# Altium schematic sheet MCU_Interconnect_Rev1.SchDoc
size A
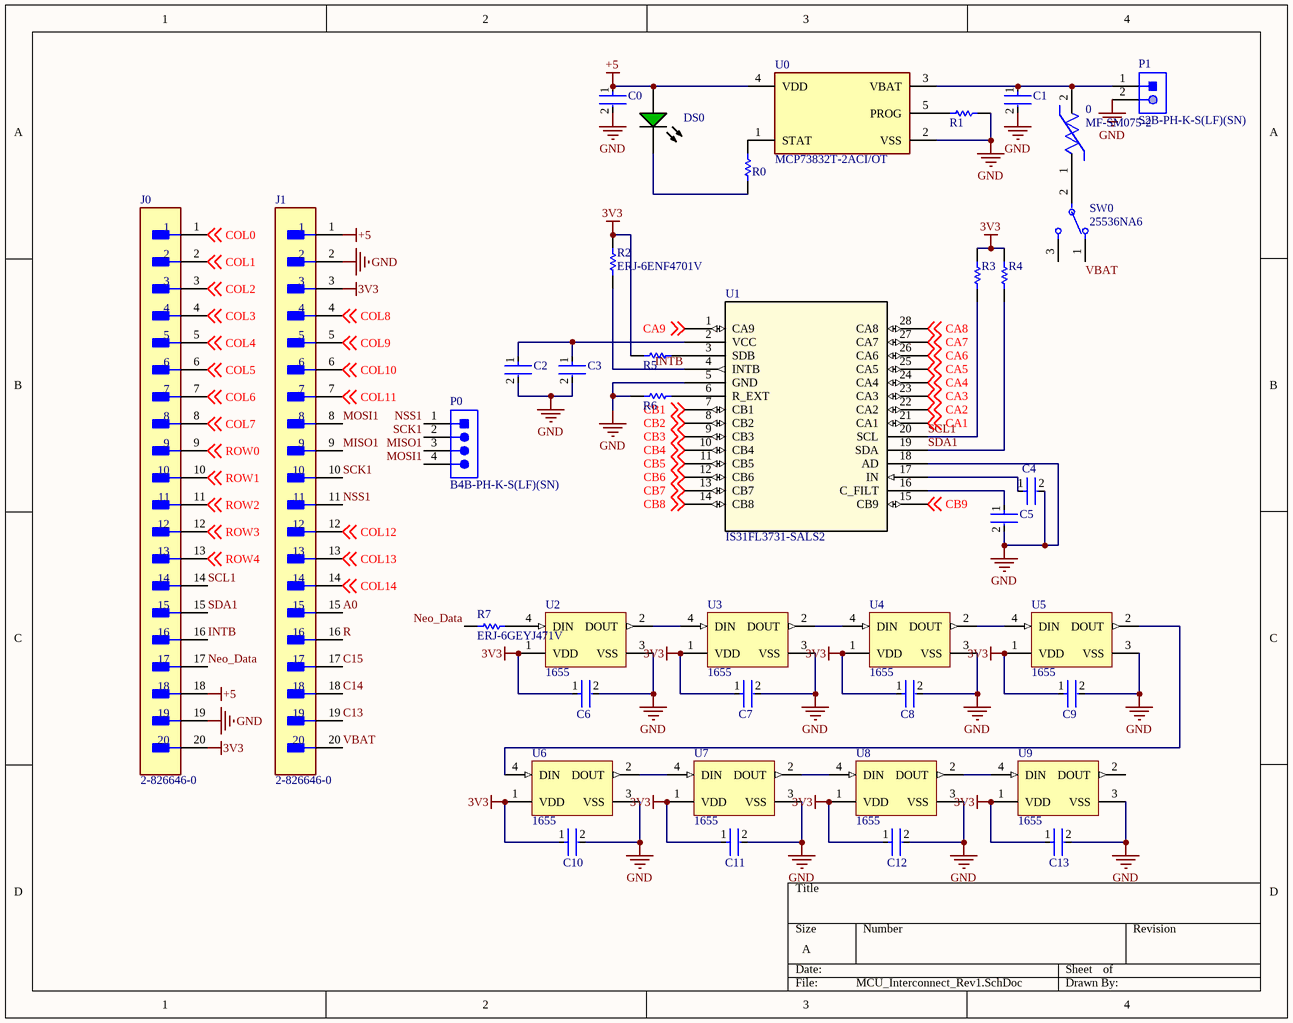
[diagram p0: MCU_Interconnect_Rev1.SchDoc]

## Parts
0  MF-SM075-2  [FP-MF-SM075-MFG]
C0  GRM21BR71C475KE51L  [FP-GRM21B-0_15-IPC_C]  (value not drawn)
C1  GRM21BR71C475KE51L  [FP-GRM21B-0_15-IPC_C]  (value not drawn)
C2  GRM219R7YA105KA12D  [FP-GRM219-0_1-MFG]  (value not drawn)
C3  GRM21B7U1A104JA01L  [FP-GRM21B-0_1-IPC_B]  (value not drawn)
C4  GCM21BR71H224KA37L  [FP-GCM21B-0_15-IPC_C]  (value not drawn)
C5  GRM21B7U1A104JA01L  [FP-GRM21B-0_1-IPC_B]  (value not drawn)
C6  GRM21B7U1A104JA01L  [FP-GRM21B-0_1-IPC_B]  (value not drawn)
C7  GRM21B7U1A104JA01L  [FP-GRM21B-0_1-IPC_B]  (value not drawn)
C8  GRM21B7U1A104JA01L  [FP-GRM21B-0_1-IPC_B]  (value not drawn)
C9  GRM21B7U1A104JA01L  [FP-GRM21B-0_1-IPC_B]  (value not drawn)
C10  GRM21B7U1A104JA01L  [FP-GRM21B-0_1-IPC_B]  (value not drawn)
C11  GRM21B7U1A104JA01L  [FP-GRM21B-0_1-IPC_B]  (value not drawn)
C12  GRM21B7U1A104JA01L  [FP-GRM21B-0_1-IPC_B]  (value not drawn)
C13  GRM21B7U1A104JA01L  [FP-GRM21B-0_1-IPC_B]  (value not drawn)
DS0  LTST-C170KGKT  [LTST-LTST-C170KGKT-2_V]  (value not drawn)
J0  2-826646-0  [FP-2-826646-0-MFG]
J1  2-826646-0  [FP-2-826646-0-MFG]
P0  B4B-PH-K-S(LF)(SN)  [JST-B4B-PH-K-S_V]
P1  S2B-PH-K-S(LF)(SN)  [JST-S2B-PH-K-S_V]
R0  RC0805FR-07470RL  [RESC2013X60X35LL10T20]  (value not drawn)
R1  ERJ-6ENF1001V  [RESC2013X70X40ML20T20]  (value not drawn)
R2  ERJ-6ENF4701V  [RESC2013X70X40NL20T20]
R3  ERJ-6ENF4701V  [RESC2013X70X40NL20T20]  (value not drawn)
R4  ERJ-6ENF4701V  [RESC2013X70X40NL20T20]  (value not drawn)
R5  ERJ-6ENF1003V  [RESC2013X70X40ML20T20]  (value not drawn)
R6  ERJ-6ENF1003V  [RESC2013X70X40ML20T20]  (value not drawn)
R7  ERJ-6GEYJ471V  [RESC2013X70X40LL20T20]
SW0  25536NA6  [FP-25536NA6-0]
U0  MCP73832T-2ACI/OT  [FP-C04-091-OT-MFG]
U1  IS31FL3731-SALS2  [SSOP-28_ISI]
U2  1655  [ADA-RGB-1655_V]
U3  1655  [ADA-RGB-1655_V]
U4  1655  [ADA-RGB-1655_V]
U5  1655  [ADA-RGB-1655_V]
U6  1655  [ADA-RGB-1655_V]
U7  1655  [ADA-RGB-1655_V]
U8  1655  [ADA-RGB-1655_V]
U9  1655  [ADA-RGB-1655_V]

## Nets
3V3: C6.1 C7.1 C8.1 C9.1 C10.1 C11.1 C12.1 C13.1 J0.20 J1.3 R2.2 R3.2 R4.2 R5.1 U2.1(VDD) U3.1(VDD) U4.1(VDD) U5.1(VDD) U6.1(VDD) U7.1(VDD) U8.1(VDD) U9.1(VDD)
+5: C0.1 DS0.2(A) J0.18 J1.1 U0.4(VDD)
GND: C0.2 C1.2 C2.2 C3.2 C4.2 C5.2 C6.2 C7.2 C8.2 C9.2 C10.2 C11.2 C12.2 C13.2 J0.19 J1.2 P1.2 R1.1 R6.1 U0.2(VSS) U1.5(GND) U1.18(AD) U2.3(VSS) U3.3(VSS) U4.3(VSS) U5.3(VSS) U6.3(VSS) U7.3(VSS) U8.3(VSS) U9.3(VSS)
A0: J1.15
C13: J1.19
C14: J1.18
C15: J1.17
CA1: U1.21(CA1) ; off-sheet CA1
CA2: U1.22(CA2) ; off-sheet CA2
CA3: U1.23(CA3) ; off-sheet CA3
CA4: U1.24(CA4) ; off-sheet CA4
CA5: U1.25(CA5) ; off-sheet CA5
CA6: U1.26(CA6) ; off-sheet CA6
CA7: U1.27(CA7) ; off-sheet CA7
CA8: U1.28(CA8) ; off-sheet CA8
CA9: U1.1(CA9) ; off-sheet CA9
CB1: U1.7(CB1) ; off-sheet CB1
CB2: U1.8(CB2) ; off-sheet CB2
CB3: U1.9(CB3) ; off-sheet CB3
CB4: U1.10(CB4) ; off-sheet CB4
CB5: U1.11(CB5) ; off-sheet CB5
CB6: U1.12(CB6) ; off-sheet CB6
CB7: U1.13(CB7) ; off-sheet CB7
CB8: U1.14(CB8) ; off-sheet CB8
CB9: U1.15(CB9) ; off-sheet CB9
COL0: J0.1 ; off-sheet COL0
COL1: J0.2 ; off-sheet COL1
COL2: J0.3 ; off-sheet COL2
COL3: J0.4 ; off-sheet COL3
COL4: J0.5 ; off-sheet COL4
COL5: J0.6 ; off-sheet COL5
COL6: J0.7 ; off-sheet COL6
COL7: J0.8 ; off-sheet COL7
COL8: J1.4 ; off-sheet COL8
COL9: J1.5 ; off-sheet COL9
COL10: J1.6 ; off-sheet COL10
COL11: J1.7 ; off-sheet COL11
COL12: J1.12 ; off-sheet COL12
COL13: J1.13 ; off-sheet COL13
COL14: J1.14 ; off-sheet COL14
INTB: J0.16 R2.1 U1.4(INTB)
MISO1: J1.9 P0.3
MOSI1: J1.8 P0.4
Neo_Data: J0.17 R7.1
NSS1: J1.11 P0.1
R: J1.16
ROW0: J0.9 ; off-sheet ROW0
ROW1: J0.10 ; off-sheet ROW1
ROW2: J0.11 ; off-sheet ROW2
ROW3: J0.12 ; off-sheet ROW3
ROW4: J0.13 ; off-sheet ROW4
SCK1: J1.10 P0.2
SCL1: J0.14 R3.1 U1.20(SCL)
SDA1: J0.15 R4.1 U1.19(SDA)
VBAT: J1.20 SW0.1
Net0_1: 0.1 SW0.2
Net0_2: 0.2 C1.1 P1.1 U0.3(VBAT)
NetC2_1: C2.1 C3.1 U1.2(VCC)
NetC4_1: C4.1 U1.17(IN)
NetC5_1: C5.1 U1.16(C_FILT)
NetDS0_1: DS0.1(K) R0.1
NetR0_2: R0.2 U0.1(STAT)
NetR1_2: R1.2 U0.5(PROG)
NetR5_2: R5.2 U1.3(SDB)
NetR6_2: R6.2 U1.6(R_EXT)
NetR7_2: R7.2 U2.4(DIN)
NetU2_2: U2.2(DOUT) U3.4(DIN)
NetU3_2: U3.2(DOUT) U4.4(DIN)
NetU4_2: U4.2(DOUT) U5.4(DIN)
NetU5_2: U5.2(DOUT) U6.4(DIN)
NetU6_2: U6.2(DOUT) U7.4(DIN)
NetU7_2: U7.2(DOUT) U8.4(DIN)
NetU8_2: U8.2(DOUT) U9.4(DIN)

Not connected (* = marked no-connect by the designer): SW0 3; U9 2(DOUT)

## Library data of the parts
0 = CMP-07400-000034-1: PTC RESET FUSE 30V 750MA 2SMD; Manufacturer: Bourns Inc.; Trip Time: 0.3s; Description: Polymeric PTC Resettable Fuse 30V 750mA Ih Surface Mount 2-SMD; Value: 0.23-1Ω; Trip Current: 1.5A; Current Rating: 80A; Hold Current: 0.75A; Automotive Grade: Grade 3; Manufacturer Part Number: MF-SM075-2; ComponentLink2URL: https://www.bourns.com/docs/Product-Datasheets/mfsm.pdf; Mouser Description: Fuse; Resettable; 0.75A; Dims 0.314x0.214x0.129"; SMT; 30VDC; DCR 0.23 Ohms; PCB; Lead Free: Yes; Device Class L1: Circuit Protection; Digikey Description: PTC RESET FUSE 30V 750MA 2SMD; Octopart: https://octopart.com/mf-sm075-2-bourns-115843; Category: Fuse; Device Class L2: PTC Resettable Fuses; Ambient Temperature Range Low: -40°C; Device Class L3: unset; Voltage Rating: 30V; Height: 3.18mm; Ambient Temperature Range High: +85°C; Resistance: 0.23-1Ω; Package: MF-SM075; ComponentLink2Description: Datasheet; Temperature Range High: +85°C; Automotive: Yes; Temperature Range Low: -40°C; Temperature: -40°C to +85°C; RoHS: TRUE
C0 C1 = CMP-06035-004324-1: Chip Multilayer Ceramic Capacitors for General Purpose, 0805, 4.7uF, X7R, 15%, 10%, 16V; Case/Package: 0805; Width: 1.25mm; Tolerance: 10%; Dielectric: X7R; Thickness: 1.25mm; Capacitance: 4.7uF; Voltage Rating (DC): 16V; Length: 2mm
C2 = CMP-06035-055256-1: Chip Multilayer Ceramic Capacitors for General Purpose, 0805, 1.0uF, X7R, 15%, 10%, 35V; Capacitance: 1uF; Thickness: 0.037inch; Package Quantity: 4000; Max Operating Temperature: 125°C; Length: 0.079inch; Case Code (Metric): 2012; Min Operating Temperature: -55°C; Voltage Rating: 35V; Mount: Surface Mount; Width: 1.25mm; Height: 0.85mm; Termination: SMD/SMT; Packaging: Tape and Reel; Voltage Rating (DC): 35V; Tolerance: 10%; Weight: 0.000335oz; Case Code (Imperial): 0805; Case/Package: 0805; Dielectric: X7R
C3 C5-C13 = CMP-06035-037063-1: Chip Multilayer Ceramic Capacitors for General Purpose, 0805, 0.10uF, U2J, -750ppm/°C, 5%, 10V; Capacitance: 100nF; Depth: 1.25mm; Voltage Rating (DC): 10V; Voltage Rating: 10V; Length: 2mm; Max Operating Temperature: 125°C; Thickness: 0.053inch; Dielectric: U2J; Termination: SMD/SMT; Package Quantity: 3000; Packaging: Tape and Reel; Case Code (Metric): 2012; Tolerance: 5%; Case Code (Imperial): 0805; Case/Package: 0805; Mount: Surface Mount; Width: 0.049inch; Height: 1.25mm; Radiation Hardening: No; Min Operating Temperature: -55°C
C4 = CMP-2007-03357-2: Ceramic Capacitor for Automotive 220nF ±10% 50VDC X7R 0805 Embossed T/R; Voltage Rating: 50V; Termination: SMD/SMT; Lead Free: Lead Free; Case/Package: 0805; Radiation Hardening: No; Width: 0.049inch; Height: 1.25mm; Mount: Surface Mount; Case Code (Metric): 2012; Min Operating Temperature: -55°C; Thickness: 0.055inch; Length: 2mm; Capacitance: 220nF; Ratings: AEC-Q200; Depth: 1.25mm; Voltage Rating (DC): 50V; REACH SVHC: No SVHC; Tolerance: 10%; Max Operating Temperature: 125°C; Voltage: 50V; Package Quantity: 1; Case Code (Imperial): 0805; Dielectric: X7R; Packaging: Tape and Reel
DS0 = CMP-2000-06620-1: Ultra Bright AlInGaP Chip LED, 75 mW, -55 to 85 degC, 2-Pin SMD (0805), RoHS, Tape and Reel; Manufacturer: Lite-On; Forward Current: 30mA; Power Dissipation Max: 75mW; Emitting Color: YellowGreen; Type: Uni-Color; Forward Voltage: 2.4V; Dominant Wave Length: 571nm; Test Current (It): 20mA; Product Length (mm): 2mm; Peak Wavelength: 574nm; Power Dissipation: 75W; Product Depth (mm): 1.25mm; DELETED: Compliant; High Brightness: Yes; Product Height (mm): 1.1mm; Luminous Intensity: 35mcd; Shape Type: Rectangular; Chip Material: AlGaInP; Viewing Angle: 130deg; Number of  Elements: 1; Reverse Voltage: 5V; Rad Hardened: No; Package Type: ChipLed; Manufacturer URL: http://www.us.liteon.com/; Mounting: SurfaceMount; Operating Temp Range: -55Cto85C; Datasheet URL: http://optoelectronics.liteon.com/upload/download/DS22-2000-073/S_110_LTST-C170KGKT.pdf; Packaging: TapeandReel; Pin Count: 2; Package Description: 2-Pin Surface Mounted Device, Body 2 x 1.25 mm; Mounting Technology: SurfaceMount; Package Reference: LTST-C170KGKT-2; Forward Current Max: 30mA; Datasheet Version: Rev. G, 06/2005; Lens Dimensions: 1.4x1.25x0.6mm; Operating Temperature Classification: Industrial; Lum Intensity: 35mcd; Main Category: ChipLED
J0 J1 = CMP-03369-000139-1: CONN HEADER VERT 20POS 2.54MM; Mating Connector Lock: No (Without); High Temperature Housing: No; Current Rating: 3A; Number of Positions: 20; PCB Mounting Orientation: Vertical; Connector Type: Plug; PCB Mount Retention: Without; Plating Thickness: 0.8um; Contact Post Length: 0.1259inch; Selectively Loaded: No (Without); Series: AMPMODU MOD II; Number of Rows: 1; Housing Color: Green; Mount: Straddle Mount; Max Operating Temperature: 105°C; Packaging: Carton; Row Spacing: 2.54mm; Board Standoff: No (Without); RoHS Compliant: Yes; Orientation: Straight; Contact Protection: No (Without); Strain Relief: No (Without); Keyed: No; Radiation Hardening: No; Package Quantity: 300; Contact Mating Length: 5.8mm; Termination: Through Hole; Contact Shape: Square; Length: 50.8mm; Pitch: 2.54mm; Stabilizers: No (Without); Gasket: No (Without); Number of Contacts: 20; Contact Gender: Male; Mating Alignment: No (Without); Min Operating Temperature: -65°C; Contact Type: Male Pin; Contact Plating: Gold; Flammability Rating: UL94 V-0; Housing Material: PBT; Color: Green; High Speed Serial Data Connector: No; Depth: 2.5mm; ELV: Compliant; Contact Material: Bronze
P0 = CMP-2000-05165-1: Male Header, Pitch 2 mm, 1 x 4 Position, Height 6 mm, Tail Length 3.4 mm, -25 to 85 degC, RoHS, Bulk; Manufacturer: JST; No of Positions: 4; Style/Orientation: StraightHeader/Plug; Pitch: 2mm; Datasheet URL: http://datasheet.octopart.com/B4B-PH-K-S%28LF%29%28SN%29-JST-datasheet-10558886.pdf; Type: ShroudedHeader; Manufacturer URL: http://www.jst.com/home2.html; Termination: Crimp; Datasheet Version: Apr-09
P1 = CMP-1755-00004-1: Male Header, Pitch 2 mm, 1 x 2 Position, Height 4.8 mm, Tail Length 3.4 mm, -25 to 85 degC, RoHS, Bulk; Case\Package: Radial; Tolerance: 20%; Capacitance: 10 uF; Voltage Rating (DC): 50 V; Packaging: Bulk; ComponentLink1URL: http://www.jst-mfg.com/product/pdf/eng/ePH.pdf; Radiation Hardening: No; Height: 11 mm; Package Quantity: 200; PackageDescription: Male Header, Pitch 2 mm, 1 x 2 Position, Height 4.8 mm, Tail Length 3.4 mm; PackageReference: S2B-PH-K-S; Diameter: 5 mm; Pins: 2; Mount: Through Hole; Max Operating Temperature: 85 degC; Min Operating Temperature: -40 degC; ComponentLink1Description: Datasheet; DatasheetVersion: Dec-12; Length: 11 mm; Lead Pitch: 2 mm; REACH SVHC: No SVHC; Voltage Rating: 50 V; RoHSCompliant: true
R0 = CMP-2000-06961-1: Chip Resistor, 470 Ohm, +/- 1%, 125 mW, -55 to 155 degC, 0805 (2012 Metric), RoHS, Tape and Reel; Manufacturer: Yageo; Power Rating: 250mW; Resistor Case Style: 0805[2012Metric]; Voltage Rating: 150V; Resistor Element Type: ThickFilm; Temperature Coefficient: ±100ppm/°C; Resistance: 470ohm; SVHC: ToBeAdvised; Datasheet Version: Rev. 7, 05/2017; Automotive Qualification Standard: -; Mounting Technology: SurfaceMount; Product Range: -; Packaging: Tape&Reel; Package Description: 2-Pin Surface Mounted Device, Body 2 x 1.25 mm; MSL: MSL1-Unlimited; Package Reference: 0805; Resistance Tolerance: ±1%; Datasheet URL: http://www.yageo.com/documents/recent/PYu-RC_Group_51_RoHS_L_7.pdf; Manufacturer URL: http://www.yageo.com/
R1 = CMP-2001-04375-5: Chip Resistor, 1 KOhm, +/- 1%, 0.125 W, -55 to 155 degC, 0805 (2012 Metric), RoHS, Tape and Reel; Manufacturer: Panasonic; Voltage Rating: 150 V; ComponentLink1URL: http://www.panasonic.com/; ComponentLink2Description: Datasheet; REACH SVHC: Yes; ComponentLink1Description: Manufacturer URL; Length: 2 mm; Height: 0.6 mm; Package Quantity: 1; PackageDescription: 2-Pin Surface Mount Device, Body 2 x 1.25 mm; Packaging: Cut Tape; PackageReference: 0805; Max Operating Temperature: 155 degC; Mounting Technology: Surface Mount; ComponentLink2URL: http://industrial.panasonic.com/cdbs/www-data/pdf/RDA0000/AOA0000C86.pdf; DatasheetVersion: 04/2015; Min Operating Temperature: -55 degC; RoHSCompliant: true; Mount: Surface Mount
R2-R4 = CMP-2001-00550-5: Chip Resistor, 4.7 KOhm, +/- 1%, 0.125 W, -55 to 155 degC, 0805 (2012 Metric), RoHS, Tape and Reel; Manufacturer: Panasonic; Voltage Rating: 150 V; Min Operating Temperature: -55 degC; PackageReference: 0805; Mounting Technology: Surface Mount; Height: 0.6 mm; PackageDescription: 2-Pin Surface Mount Device, Body 2 x 1.25 mm; RoHSCompliant: true; Length: 2 mm; REACH SVHC: Yes; Packaging: Tape and Reel; Pins: 2; Mount: Surface Mount; ComponentLink2Description: Datasheet; ComponentLink1URL: http://www.panasonic.com/; ComponentLink1Description: Manufacturer URL; DatasheetVersion: 04/2015; Package Quantity: 5000; ComponentLink2URL: http://industrial.panasonic.com/cdbs/www-data/pdf/RDA0000/AOA0000C86.pdf; Max Operating Temperature: 155 degC
R5 R6 = CMP-2001-04377-1: 100kOhm; Manufacturer: Panasonic; Part Number: ERJ-6ENF1003V
R7 = CMP-2001-00419-1: Manufacturer: Panasonic; Part Number: ERJ-6GEYJ471V
SW0 = CMP-47022-000007-1: SWITCH SLIDE SPDT 4A 125V; Current Rating: 1A; Voltage Rating (DC): 30V; Mechanical Life: 20000Cycles; Contact Resistance: 10mR; Electrical Life: 10000Cycles; Switch Function: On-On; Actuator Material: Nylon; Actuator Length: 6mm; Illumination Type: Non-Illuminated; Switch Travel: 4mm; Actuator Type: Standard; Max Voltage Rating (AC): 250V; Min Operating Temperature: -40°C; Max Voltage Rating (DC): 30V; Contact Current Rating: 4A; Series: 25000N; Termination: PC Pin; Orientation: Right Angle; Contact Plating: Silver; Throw Configuration: SPDT; Max Operating Temperature: 85°C; Contact Material: Silver; Packaging: Bulk; Mount: Through Hole; Voltage Rating (AC): 125V; Package Quantity: 100
U0 = CMP-0133-00138-2: IC LI-ION/LI-POLY CTRLR SOT23-5; Output Current: 10mA; Output Voltage: 4.2V; Max Output Current: 500mA; Max Power Dissipation: 1.54W; Min Output Voltage: 4.168V; Number of Channels: 1; Max Supply Voltage: 6V; Min Supply Voltage: 3.75V; Max Output Voltage: 4.5V; Case/Package: SOT-23; Lead Free: Lead Free; Termination: SMD/SMT; Min Operating Temperature: -40°C; Max Operating Temperature: 85°C; Height: 1.3mm; Length: 3.1mm; Mount: Surface Mount; Package Quantity: 3000; Number of Pins: 5; Packaging: Tape and Reel; REACH SVHC: No SVHC; Contact Plating: Tin; Width: 1.8mm; Number of Cells: 1; Number of Outputs: 1; Power Dissipation: 1.54W; Max Charge Current: 500mA; Max Input Voltage: 6V; Radiation Hardening: No
U1 = IS31FL3731-SALS2: No Description Available; Vendor: ISSI; Built_By: EMA_Cory; SourceLibrary: ISSI_2020-02-04; Datasheet: http://www.issi.com/WW/pdf/31FL3731.pdf; Manufacturer_Part_Number: IS31FL3731-SALS2; Copyright: Copyright (C) 2018 Accelerated Designs. All rights reserved; RefDes: RefDes; Type: DEV
U2-U9 = CMP-2000-05026-1: Intelligent Control LED Integrated Light Source, 3.5 to 5.3 V, -25 to 80 degC, 4-Pin SMD, RoHS, Tape and Reel; Manufacturer: Adafruit-Industries-LLC; Number of LEDs: 10; Configuration: Discrete; Utilized LED: WS2812(5050); Datasheet URL: http://datasheet.octopart.com/ADA1655-Adafruit-Industries-datasheet-32028139.pdf; Series: Neopixel; Interface: -; Package Description: 4-Pin Surface Mount Device, Body 5 x 5 mm; Color: Red,Green,Blue(RGB); Category: Optoelectronics; Controller Type: -; Package Reference: 1655; Manufacturer URL: https://www.adafruit.com/; Mounting Type: SurfaceMount; Datasheet Version: May-13; Size / Dimension: 5.00mmLx5.00mmW; Family: Addressable,Specialty